# EAGLE design LCD_KEYb_final_rev02 (EAGLE 9.6.2)
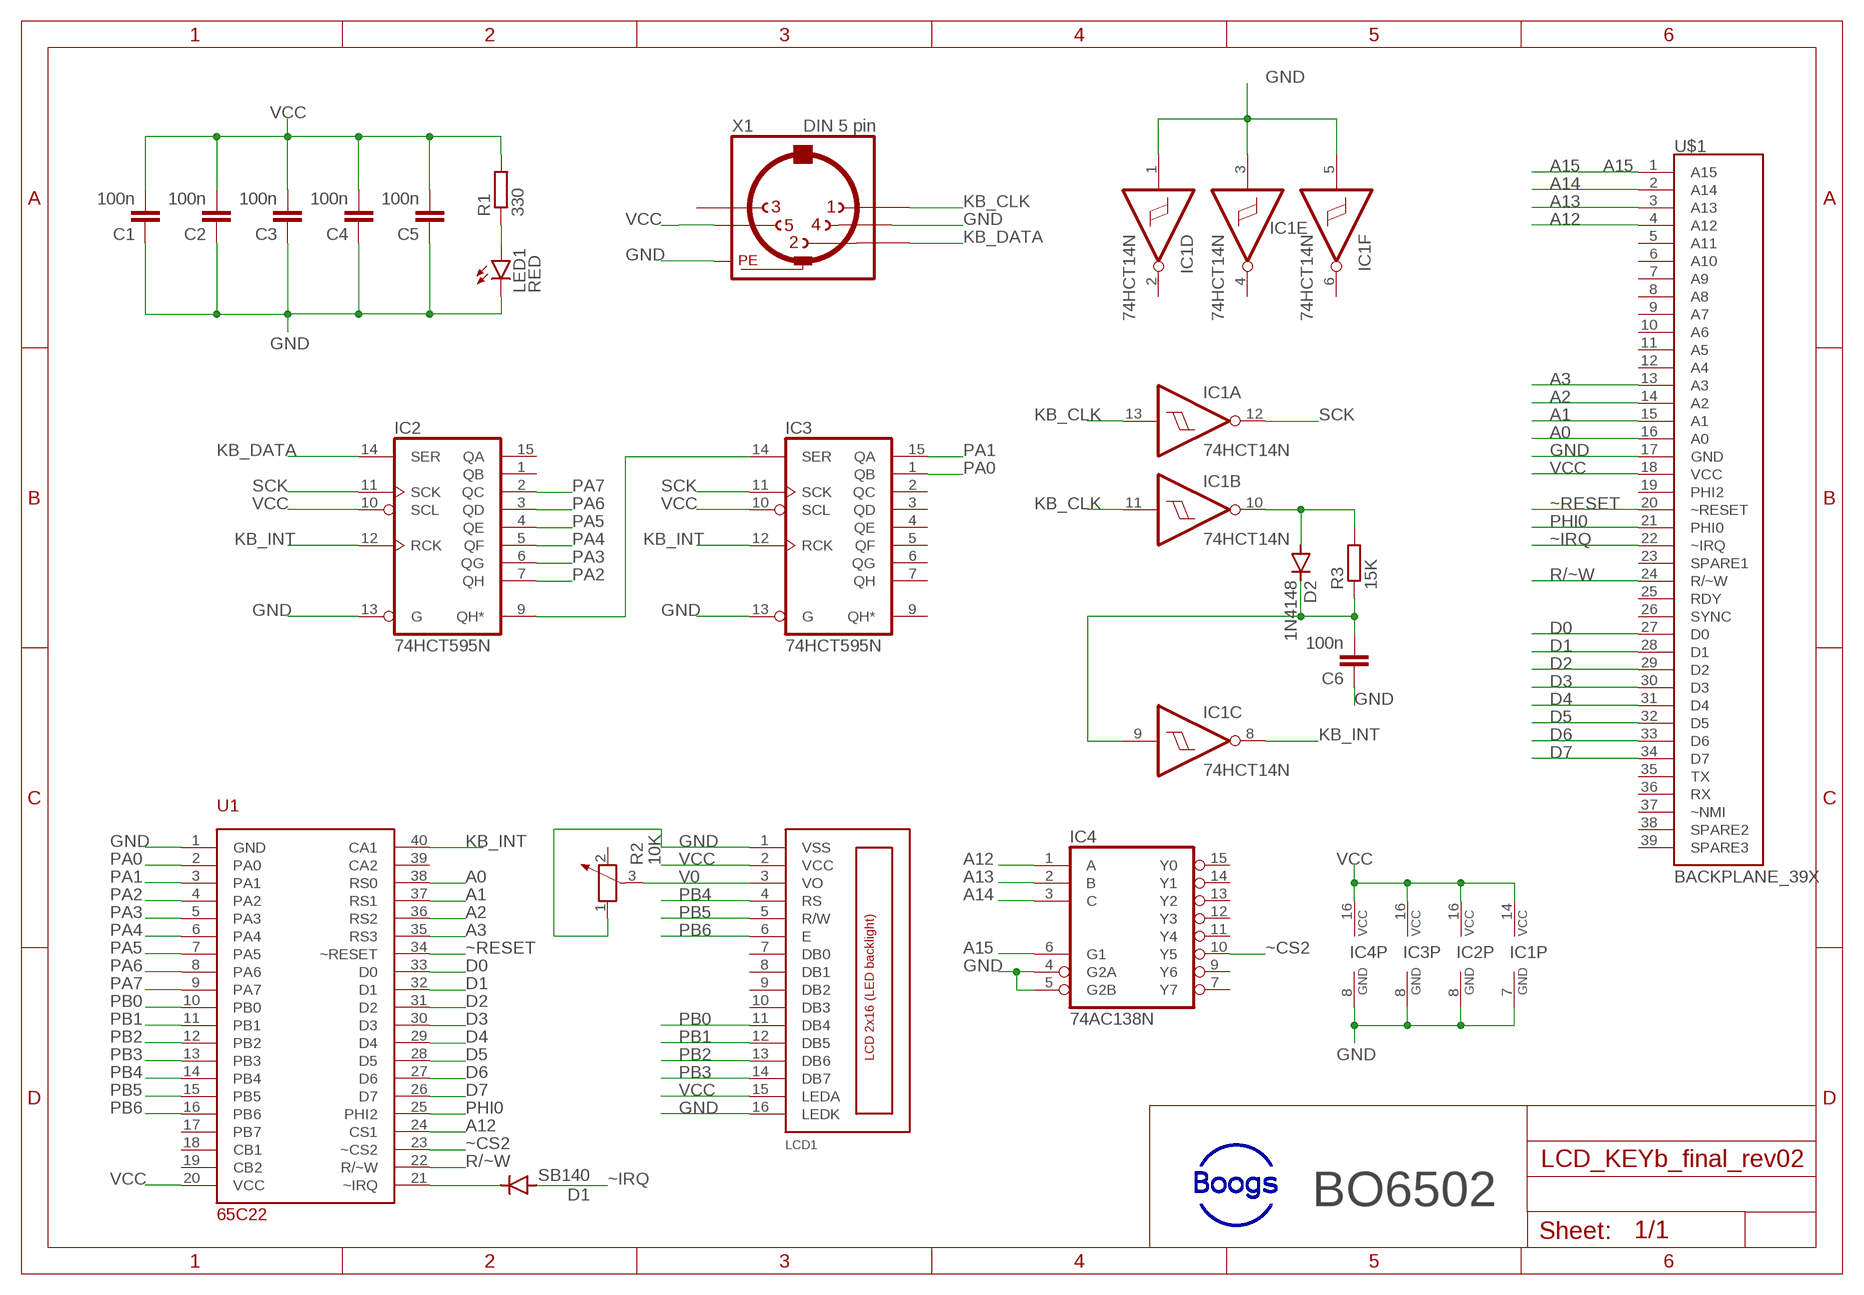
[diagram p0: schematic, sheet 1]

## Parts
C1  100n  C-EU025-025X050  [C025-025X050]
C2  100n  C-EU025-025X050  [C025-025X050]
C3  100n  C-EU025-025X050  [C025-025X050]
C4  100n  C-EU025-025X050  [C025-025X050]
C5  100n  C-EU025-025X050  [C025-025X050]
C6  100n  C-EU025-025X050  [C025-025X050]
D1  SB140  1N4004  [DO41-10]
D2  1N4148  1N4148DO35-7  [DO35-7]
IC1  74HCT14N  [DIL14]
IC2  74HCT595N  [DIL16]
IC3  74HCT595N  [DIL16]
IC4  74AC138N  [DIL16]
LCD1  LCD_2X16_SIL  [HY-1602F]
LED1  RED  LED5MM  [LED5MM]
R1  330  R-EU_0207/10  [0207/10]
R2  10K  POTENTIOMETER_PT-10  [PT-10]
R3  15K  R-EU_0207/10  [0207/10]
U1  65C22  [DIL40]
U$1  BACKPLANE_39X  [BP_39X]
X1  DIN 5 pin  MAB5SH  [MAB5SH]

## Nets
A0: U1.38(RS0) U$1.16(A0)
A1: U1.37(RS1) U$1.15(A1)
A2: U1.36(RS2) U$1.14(A2)
A3: U1.35(RS3) U$1.13(A3)
A12: IC4.1(A) U1.24(CS1) U$1.4(A12)
A13: IC4.2(B) U$1.3(A13)
A14: IC4.3(C) U$1.2(A14)
A15: IC4.6(G1) U$1.1(A15)
D0: U1.33(D0) U$1.27(D0)
D1: U1.32(D1) U$1.28(D1)
D2: U1.31(D2) U$1.29(D2)
D3: U1.30(D3) U$1.30(D3)
D4: U1.29(D4) U$1.31(D4)
D5: U1.28(D5) U$1.32(D5)
D6: U1.27(D6) U$1.33(D6)
D7: U1.26(D7) U$1.34(D7)
GND: C1.1 C2.1 C3.1 C4.1 C5.1 C6.1 IC1.1(D:I) IC1.3(E:I) IC1.5(F:I) IC1.7(P:GND) IC2.8(GND) IC2.13(G) IC3.8(GND) IC3.13(G) IC4.4(G2A) IC4.5(G2B) IC4.8(GND) LCD1.1(VSS) LCD1.16(LEDK) LED1.K(C) R2.1 U1.1(GND) U$1.17(GND) X1.4 X1.PE X1.PE@(PE)
KB_CLK: IC1.11(B:I) IC1.13(A:I) X1.1
KB_DATA: IC2.14(SER) X1.2
KB_INT: IC1.8(C:O) IC2.12(RCK) IC3.12(RCK) U1.40(CA1)
N$1: D1.C U1.21(~IRQ)
N$2: IC2.9(QH*) IC3.14(SER)
N$4: D2.A IC1.10(B:O) R3.2
N$5: C6.2 D2.C IC1.9(C:I) R3.1
N$6: LED1.A R1.1
PA0: IC3.1(QB) U1.2(PA0)
PA1: IC3.15(QA) U1.3(PA1)
PA2: IC2.7(QH) U1.4(PA2)
PA3: IC2.6(QG) U1.5(PA3)
PA4: IC2.5(QF) U1.6(PA4)
PA5: IC2.4(QE) U1.7(PA5)
PA6: IC2.3(QD) U1.8(PA6)
PA7: IC2.2(QC) U1.9(PA7)
PB0: LCD1.11(DB4) U1.10(PB0)
PB1: LCD1.12(DB5) U1.11(PB1)
PB2: LCD1.13(DB6) U1.12(PB2)
PB3: LCD1.14(DB7) U1.13(PB3)
PB4: LCD1.4(RS) U1.14(PB4)
PB5: LCD1.5(R/W) U1.15(PB5)
PB6: LCD1.6(E) U1.16(PB6)
PHI0: U1.25(PHI2) U$1.21(PHI0)
R/~W: U1.22(R/~W) U$1.24(R/~W)
SCK: IC1.12(A:O) IC2.11(SCK) IC3.11(SCK)
V0: LCD1.3(VO) R2.3
VCC: C1.2 C2.2 C3.2 C4.2 C5.2 IC1.14(P:VCC) IC2.10(SCL) IC2.16(VCC) IC3.10(SCL) IC3.16(VCC) IC4.16(VCC) LCD1.2(VCC) LCD1.15(LEDA) R1.2 U1.20(VCC) U$1.18(VCC) X1.5
~CS2: IC4.10(Y5) U1.23(~CS2)
~IRQ: D1.A U$1.22(~IRQ)
~RESET: U1.34(~RESET) U$1.20(~RESET)
Unconnected: IC1.2(D:O) IC1.4(E:O) IC1.6(F:O) IC2.1(QB) IC2.15(QA) IC3.2(QC) IC3.3(QD) IC3.4(QE) IC3.5(QF) IC3.6(QG) IC3.7(QH) IC3.9(QH*) IC4.7(Y7) IC4.9(Y6) IC4.11(Y4) IC4.12(Y3) IC4.13(Y2) IC4.14(Y1) IC4.15(Y0) LCD1.7(DB0) LCD1.8(DB1) LCD1.9(DB2) LCD1.10(DB3) R2.2 U1.17(PB7) U1.18(CB1) U1.19(CB2) U1.39(CA2) U$1.5(A11) U$1.6(A10) U$1.7(A9) U$1.8(A8) U$1.9(A7) U$1.10(A6) U$1.11(A5) U$1.12(A4) U$1.19(PHI2) U$1.23(SPARE1) U$1.25(RDY) U$1.26(SYNC) U$1.35(TX) U$1.36(RX) U$1.37(~NMI) U$1.38(SPARE2) U$1.39(SPARE3) X1.3

## Notes on the sheet
- BO6502

## Library data of the parts
C1-C6 = rcl:C-EU: CAPACITOR, European symbol; SPICEPREFIX: C
D1 = diode:1N4004: DIODE general purpose rectifier, 1 A
D2 = diode:1N4148: DIODE high speed (Philips)
IC1 = 74xx-eu:74*14: Hex schmitt trigger INVERTER
IC2 IC3 = 74xx-eu:74*595: 8-bit SHIFT REGISTER, output latch
IC4 = 74xx-eu:74*138: 3-line to 8-line DECODER/DEMULTIPLEXER
LCD1 = lcd_2x16_led_backlight:LCD_2X16_SIL
LED1 = led:LED: LED OSRAM: - CHIPLED LG R971, LG N971, LY N971, LG Q971, LY Q971, LO R971, LY R971 LH N974, LH R974 LS Q976, LO Q976, LY Q976 LO Q996 - Hyper CHIPLED LW Q18S LB Q993, LB Q99A, LB R99A - SideLED LS A670, LO A670, LY A670, LG A670, LP A670 LB A673, LV A673, LT A673, LW A673 LH A674 LY A675 LS A676, LA A676, LO A676, LY A676, LW A676 LS A679, LY A679, LG A679 - Hyper Micro SIDELED® LS Y876, LA Y876, LO Y876, LY Y876 LT Y87S - SmartLED LW L88C, LW L88S LB L89C, LB L89S, LG L890 LS L89K, LO L89K, LY L89K LS L896, LA L896, LO L896, LY L896 - TOPLED LS T670, LO T670, LY T670, LG T670, LP T670 LSG T670, LSP T670, LSY T670, LOP T670, LYG T670 LG T671, LOG T671, LSG T671 LB T673, LV T673, LT T673, LW T673 LH T674 LS T676, LA T676, LO T676, LY T676, LB T676, LH T676, LSB T676, LW T676 LB T67C, LV T67C, LT T67C, LS T67K, LO T67K, LY T67K, LW E67C LS E67B, LA E67B, LO E67B, LY E67B, LB E67C, LV E67C, LT E67C LW T67C LS T679, LY T679, LG T679 LS T770, LO T770, LY T770, LG T770, LP T770 LB T773, LV T773, LT T773, LW T773 LH T774 LS E675, LA E675, LY E675, LS T675 LS T776, LA T776, LO T776, LY T776, LB T776 LHGB T686 LT T68C, LB T68C - Hyper Mini TOPLED® LB M676 - Mini TOPLED Santana® LG M470 LS M47K, LO M47K, LY M47K Source: http://www.osram.convergy.de LUXEON: - LUMILED® LXK2-PW12-R00, LXK2-PW12-S00, LXK2-PW14-U00, LXK2-PW14-V00 LXK2-PM12-R00, LXK2-PM12-S00, LXK2-PM14-U00 LXK2-PE12-Q00, LXK2-PE12-R00, LXK2-PE12-S00, LXK2-PE14-T00, LXK2-PE14-U00 LXK2-PB12-K00, LXK2-PB12-L00, LXK2-PB12-M00, LXK2-PB14-N00, LXK2-PB14-P00, LXK2-PB14-Q00 LXK2-PR12-L00, LXK2-PR12-M00, LXK2-PR14-Q00, LXK2-PR14-R00 LXK2-PD12-Q00, LXK2-PD12-R00, LXK2-PD12-S00 LXK2-PH12-R00, LXK2-PH12-S00 LXK2-PL12-P00, LXK2-PL12-Q00, LXK2-PL12-R00 Source: www.luxeon.com KINGBRIGHT: KA-3528ASYC Source: www.kingbright.com
R1 R3 = rcl:R-EU_: RESISTOR, European symbol; SPICEPREFIX: R
R2 = rcl:POTENTIOMETER_: Potentiometer; SPICEMODEL: POT; SPICEPREFIX: X
U1 = 65xx_family:65C22
U$1 = 65xx_family:BACKPLANE_39X; A15: A15
X1 = con-hirschmann_mod:MAB5SH: Female CONNECTOR 5 pins 90 deg. with shield, horizontal (DIN 41524); OC_FARNELL: 809883; OC_NEWARK: unknown

## Board
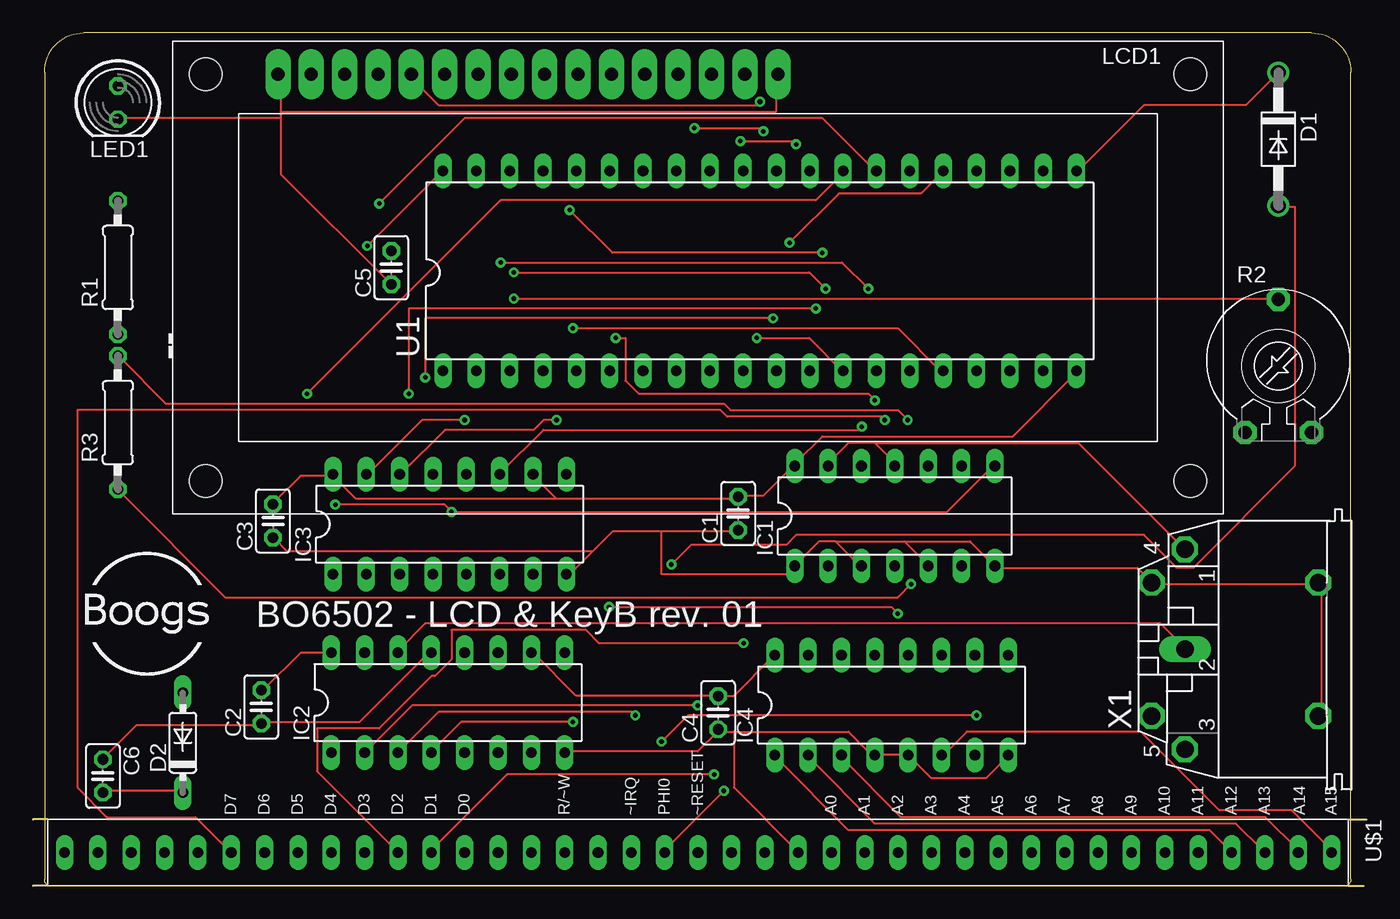
[diagram p1: board, top side]
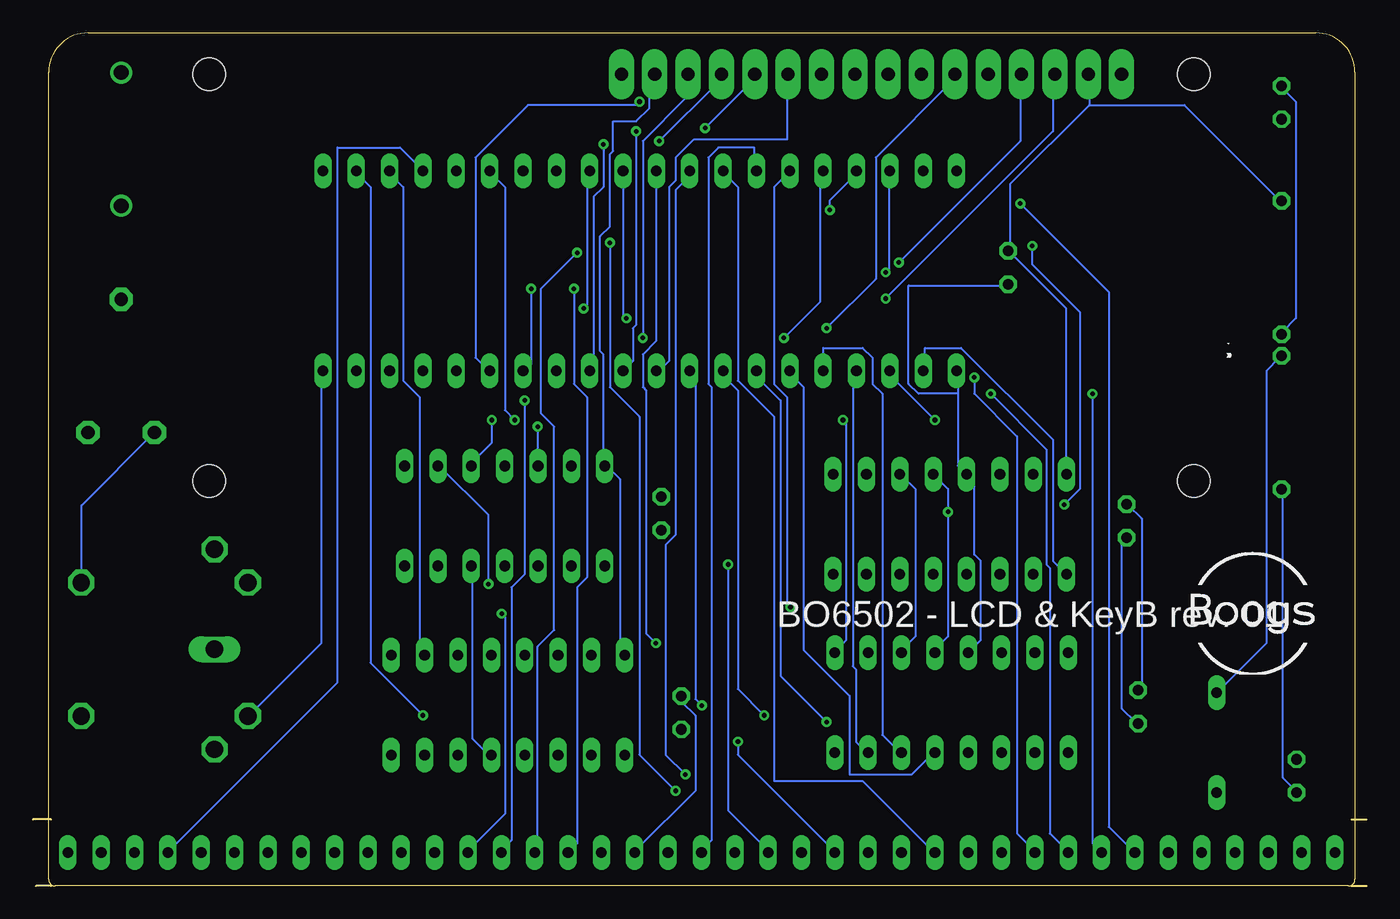
[diagram p2: board, bottom side, seen from below]

Size 101.6 x 65 mm. Coordinates in mm from the lower left corner, seen from the top.
Outline: 1.14,5.08 0,5.08
Outline: 1.14,0 0,0
Outline: 100.2,5.08 101.6,5.08
Outline: 100.2,0 101.35,0
Outline: 1.39,0 99.89,0 arc90 100.39,0.5 100.39,62 arc90 97.39,65 3.89,65 arc90 0.89,62 0.89,0.5 arc90 1.39,0
Copper layers (1*16): Top 0.035mm / dielectric 1.5mm / Bottom 0.035mm
Design rules "default *": minimum track width 6mil, minimum drill 0.35mm, track to track 10mil, track to pad 10mil, pad to pad 10mil, via to via 10mil, smd to smd 6mil, copper to edge 40mil, drill to drill 6mil, minimum pad ring 10mil, minimum via ring 8mil, stop-mask expansion 4mil, vias tented up to drill 15mil, thermal gap 10mil

### Footprints (pad centres in the part's own frame; a part is rotated, then mirrored left to right if it is on the bottom)
C025-025X050 = drill 0.813 octagon: 1 -1.27,0; 2 1.27,0
DO41-10 = drill 1.118: A 5.08,0; C -5.08,0
DO35-7 = drill 0.813 long: A 3.81,0; C -3.81,0
DIL14 = drill 0.813 long: 1 -7.62,-3.81; 2 -5.08,-3.81; 3 -2.54,-3.81; 4 0,-3.81; 5 2.54,-3.81; 6 5.08,-3.81; 7 7.62,-3.81; 8 7.62,3.81; 9 5.08,3.81; 10 2.54,3.81; 11 0,3.81; 12 -2.54,3.81; 13 -5.08,3.81; 14 -7.62,3.81
DIL16 = drill 0.813 long: 1 -8.89,-3.81; 2 -6.35,-3.81; 3 -3.81,-3.81; 4 -1.27,-3.81; 5 1.27,-3.81; 6 3.81,-3.81; 7 6.35,-3.81; 8 8.89,-3.81; 9 8.89,3.81; 10 6.35,3.81; 11 3.81,3.81; 12 1.27,3.81; 13 -1.27,3.81; 14 -3.81,3.81; 15 -6.35,3.81; 16 -8.89,3.81
HY-1602F = drill 1 pad 1.93 long: 1 2.54,0; 2 5.08,0; 3 7.62,0; 4 10.16,0; 5 12.7,0; 6 15.24,0; 7 17.78,0; 8 20.32,0; 9 22.86,0; 10 25.4,0; 11 27.94,0; 12 30.48,0; 13 33.02,0; 14 35.56,0; 15 38.1,0; 16 40.64,0 | hole 2.5: -2.96,0; 72.04,0; -2.96,-31; 72.04,-31
LED5MM = drill 0.813 octagon: A -1.27,0; K 1.27,0
0207/10 = drill 0.813 octagon: 1 -5.08,0; 2 5.08,0
PT-10 = drill 1.016 pad 1.778 octagon: 1 -2.54,-5.08; 2 2.54,-5.08; 3 0,5.08
DIL40 = drill 0.813 long: 1 -24.13,-7.62; 2 -21.59,-7.62; 3 -19.05,-7.62; 4 -16.51,-7.62; 5 -13.97,-7.62; 6 -11.43,-7.62; 7 -8.89,-7.62; 8 -6.35,-7.62; 9 -3.81,-7.62; 10 -1.27,-7.62; 11 1.27,-7.62; 12 3.81,-7.62; 13 6.35,-7.62; 14 8.89,-7.62; 15 11.43,-7.62; 16 13.97,-7.62; 17 16.51,-7.62; 18 19.05,-7.62; 19 21.59,-7.62; 20 24.13,-7.62; 21 24.13,7.62; 22 21.59,7.62; 23 19.05,7.62; 24 16.51,7.62; 25 13.97,7.62; 26 11.43,7.62; 27 8.89,7.62; 28 6.35,7.62; 29 3.81,7.62; 30 1.27,7.62; 31 -1.27,7.62; 32 -3.81,7.62; 33 -6.35,7.62; 34 -8.89,7.62; 35 -11.43,7.62; 36 -13.97,7.62; 37 -16.51,7.62; 38 -19.05,7.62; 39 -21.59,7.62; 40 -24.13,7.62
BP_39X = drill 0.813 long: 1 1.27,59.69; 2 1.27,57.15; 3 1.27,54.61; 4 1.27,52.07; 5 1.27,49.53; 6 1.27,46.99; 7 1.27,44.45; 8 1.27,41.91; 9 1.27,39.37; 10 1.27,36.83; 11 1.27,34.29; 12 1.27,31.75; 13 1.27,29.21; 14 1.27,26.67; 15 1.27,24.13; 16 1.27,21.59; 17 1.27,19.05; 18 1.27,16.51; 19 1.27,13.97; 20 1.27,11.43; 21 1.27,8.89; 22 1.27,6.35; 23 1.27,3.81; 24 1.27,1.27; 25 1.27,-1.27; 26 1.27,-3.81; 27 1.27,-6.35; 28 1.27,-8.89; 29 1.27,-11.43; 30 1.27,-13.97; 31 1.27,-16.51; 32 1.27,-19.05; 33 1.27,-21.59; 34 1.27,-24.13; 35 1.27,-26.67; 36 1.27,-29.21; 37 1.27,-31.75; 38 1.27,-34.29; 39 1.27,-36.83
MAB5SH = drill 1.321 octagon: 1 7.62,5.08; 3 -7.62,5.08; 4 5.08,7.62; 5 -5.08,7.62; PE -5.08,-5.08; PE@ 5.08,-5.08 | drill 1.321 long: 2 0,5.08

### Placement (x,y rotation side)
C1  53.72,28.38 90 top
C2  17.4,13.65 90 top
C3  18.29,27.81 90 top
C4  52.2,13.21 90 top
C5  27.3,47.12 90 top
C6  5.33,8.38 270 top
D1  94.87,56.9 270 top
D2  11.43,10.92 90 top
IC1  65.66,28.19 0 top
IC2  31.62,13.97 0 top
IC3  31.75,27.56 0 top
IC4  65.41,13.78 0 top
LCD1  16.13,61.85 0 top
LED1  6.48,59.69 270 top
R1  6.48,47.12 90 top
R2  94.87,39.62 0 top
R3  6.48,35.31 90 top
U1  55.37,46.86 0 top
U$1  39.24,3.81 270 top
X1  92.84,18.03 90 top

### Tracks (layer width: path | path; a pad name or v marks a point on that pad's centre or on a via)
A0  (via drill 0.35)
  Top 0.152: v60.39,45.5 59.14,46.75 v36.64,46.75
  Bottom 0.152: v60.39,45.5 60.39,38.25 59.39,37.25 59.39,23.5 60.14,22.75 60.14,3.25 60.64,2.75 U$1.16 | v36.64,46.75 36.39,47 36.39,54.25 U1.38
A1  (via drill 0.35)
  Top 0.152: v40.89,51.5 44.14,48.25 v60.14,48.25
  Bottom 0.152: v40.89,51.5 40.89,52.25 38.89,54.25 U1.37 | v60.14,48.25 62.89,45.5 62.89,36 61.89,35 61.89,19.5 63.14,18.25 63.14,2.75 U$1.15
A2  (via drill 0.35)
  Top 0.152: v64.14,37 63.64,37.5 46.14,37.5 45.14,38.5 45.14,41.75 v44.39,41.75
  Bottom 0.152: v64.14,37 64.14,23.75 65.14,22.75 65.14,3.5 65.89,2.75 U$1.14 | v44.39,41.75 41.64,44.5 41.64,54.25 U1.36
A3  (via drill 0.35)
  Top 0.152: v65.89,20.75 65.39,21.25 v43.89,21.25
  Bottom 0.152: v65.89,20.75 65.64,20.5 65.64,5.5 68.39,2.75 U$1.13 | v43.89,21.25 44.14,21.5 44.14,37.25 45.14,38.25 45.14,53.25 44.14,54.25 U1.35
A12
  Top 0.152: IC4.1 56.64,9.75 62.14,4.25 89.64,4.25 91.14,2.75 U$1.4
  Bottom 0.152: U1.24 71.89,54.5 73.64,56.25 78.39,56.25 78.39,15.5 91.14,2.75 U$1.4
A13
  Top 0.152: IC4.2 59.14,9.75 64.14,4.75 91.64,4.75 93.64,2.75 U$1.3
A14
  Top 0.152: IC4.3 61.64,9.75 66.14,5.25 93.89,5.25 96.39,2.75 U$1.2
A15
  Top 0.152: IC4.6 69.39,10 71.14,11.75 84.39,11.75 90.39,5.75 95.89,5.75 98.89,2.75 U$1.1
D0
  Bottom 0.152: U$1.27 33.14,2.75 38.39,8 45.14,8 45.14,35.75 47.89,38.5 47.89,53.25 48.89,54.25 U1.33
D1  (via drill 0.35)
  Top 0.152: v51.89,8.5 36.14,8.5 30.39,2.75 U$1.28
  Bottom 0.152: v51.89,8.5 53.39,10 53.39,26 52.64,26.75 52.64,53 51.64,54 51.64,54.25 U1.32
D2  (via drill 0.35)
  Top 0.152: v54.14,18.5 43.14,18.5 42.14,19.5 31.89,19.5 31.89,17.25 30.64,16 30.39,16 26.39,12 21.64,12 21.64,8.75 27.64,2.75 U$1.29
  Bottom 0.152: v54.14,18.5 54.89,19.25 54.89,37.75 55.14,38 55.14,40.5 54.14,41.5 54.14,54.25 U1.31
D3  (via drill 0.35)
  Top 0.152: v29.89,38.75 29.89,43.25 v56.39,43.25
  Bottom 0.152: v29.89,38.75 29.89,37.5 26.64,34.25 26.64,4 25.39,2.75 U$1.30 | v56.39,43.25 56.64,43.5 56.64,54.25 U1.30
D4  (via drill 0.35)
  Top 0.152: v28.64,37.5 28.64,44 v59.64,44
  Bottom 0.152: v28.64,37.5 24.39,33.25 24.39,24.5 24.14,24.25 24.14,4 22.89,2.75 U$1.31 | v59.64,44 59.39,44.25 59.39,54.25 U1.29
D5  (via drill 0.35)
  Top 0.152: v20.89,37.5 35.64,52.25 59.64,52.25 61.64,54.25 U1.28
  Bottom 0.152: v20.89,37.5 20.89,3.25 20.39,2.75 U$1.32
D6  (via drill 0.35)
  Top 0.152: v26.39,52 32.89,58.5 60.14,58.5 64.14,54.5 U1.27
  Bottom 0.152: v26.39,52 19.64,45.25 19.64,4.5 17.89,2.75 U$1.33
D7  (via drill 0.35)
  Top 0.152: v64.89,35.5 64.64,35.75 52.89,35.75 52.39,36.25 3.39,36.25 3.39,7.5 5.64,5.25 12.39,5.25 14.89,2.75 U$1.34
  Bottom 0.152: v64.89,35.5 65.64,36.25 65.64,53.25 66.64,54.25 U1.26
GND
  Top 0.152: 18.89,59 18.89,61.75 LCD1.1 | 18.89,59 18.89,58.5 | 18.89,58.5 18.89,54.25 27.14,46 C5.1 | 18.89,58.5 6.64,58.5 LED1.K | 18.89,59 56.64,59 56.64,61.75 LCD1.16 | C6.1 5.39,9.75 7.89,12.25 17.39,12.25 C2.1 17.64,12.5 24.89,12.5 30.14,17.75 IC2.13 | IC4.8 74.14,9.75 72.64,8.25 68.39,8.25 66.89,9.75 IC4.5 66.64,10 64.14,10 IC4.4 63.89,10 62.14,11.75 53.39,11.75 | IC2.8 40.64,10.25 50.64,10.25 52.14,11.75 C4.1 52.39,11.75 53.39,11.75 | 53.39,11.75 53.39,7.5 58.14,2.75 U$1.17 | X1.PE 98.14,13 98.14,23 X1.PE@ 97.89,23 85.39,23 X1.4 85.14,23.25 84.14,24.25 73.39,24.25 IC1.7 73.14,24.5 71.39,26.25 66.39,26.25 | 42.64,25.5 44.14,27 47.89,27 | 42.64,25.5 40.89,23.75 IC3.8 | 47.89,27 53.64,27 C1.1 | 61.14,26.25 59.89,26.25 58.14,24.5 IC1.1 57.89,24.25 57.39,23.75 47.89,23.75 47.89,27 | 61.14,26.25 62.89,24.5 IC1.3 | 66.39,26.25 68.14,24.5 IC1.5 | 61.14,26.25 66.39,26.25 | 42.64,25.5 19.39,25.5 18.39,26.5 C3.1
  Bottom 0.152: 31.14,37.5 31.14,39 U1.1 | 31.14,37.5 31.14,32 30.64,31.5 IC3.13 30.39,31.25 29.89,30.75 29.89,25.25 29.39,24.75 29.39,18.75 30.14,18 IC2.13 | C3.1 18.39,26.5 18.64,26.25 18.64,13.5 17.64,12.5 C2.1 | R2.1 92.39,34.5 97.89,29 97.89,23.25 X1.PE@ | IC4.5 66.89,10 68.14,11.25 68.14,24.25 IC1.5 | 31.14,37.5 34.14,37.5 34.89,38.25 34.89,45.75 27.39,45.75 C5.1
KB_CLK
  Top 0.152: 64.14,33.75 62.14,33.75 60.64,32.25 IC1.13 | 64.14,33.75 65.64,32.25 IC1.11 | 64.14,33.75 79.64,33.75 87.64,25.75 X1.1
KB_DATA
  Top 0.152: IC2.14 27.89,18 29.89,20 85.89,20 87.64,18.25 X1.2
KB_INT  (via drill 0.35)
  Top 0.152: IC1.8 73.14,32 69.64,28.5 v31.89,28.5 31.77,28.65 31.37,29.06 v23.04,29.06 | v25.48,48.77 31.17,54.46 U1.40
  Bottom 0.152: IC2.12 32.89,18 31.89,19 v31.89,28.5 31.89,30.25 32.89,31.25 IC3.12 | v25.48,48.77 25.48,47.35 21.82,43.69 21.82,30.28 v23.04,29.06
N$1
  Top 0.152: U1.21 79.64,54.5 84.64,59.5 92.39,59.5 94.64,61.75 D1.C
N$2  (via drill 0.35)
  Top 0.152: v39.89,35.5 38.89,35.5 38.14,34.75 31.39,34.75 28.14,31.5 IC3.14
  Bottom 0.152: v39.89,35.5 39.64,35.25 39.64,18.75 40.39,18 IC2.9
N$4  (via drill 0.35)
  Top 0.152: v66.64,35.5 65.89,36.25 53.14,36.25 52.64,36.75 10.14,36.75 6.64,40.25 R3.2
  Bottom 0.152: D2.A 11.39,14.75 7.64,18.5 7.64,39.25 6.64,40.25 R3.2 | v66.64,35.5 66.64,33.75 68.14,32.25 IC1.10
N$5  (via drill 0.35)
  Top 0.152: C6.2 5.39,7.25 11.39,7.25 D2.C | v66.89,23 65.89,22 14.64,22 6.64,30 R3.1
  Bottom 0.152: R3.1 6.39,30 6.39,8.25 5.39,7.25 C6.2 | v66.89,23 66.89,28.25 70.64,32 IC1.9
N$6
  Bottom 0.152: R1.1 6.39,42.25 5.39,43.25 5.39,59.75 6.39,60.75 LED1.A
PA0
  Bottom 0.152: IC3.1 22.89,23.75 23.89,24.75 23.89,34 30.89,41 33.64,41 33.64,39.25 U1.2
PA1  (via drill 0.35)
  Top 0.152: v32.89,35.5 29.64,35.5 25.64,31.5 IC3.15
  Bottom 0.152: v32.89,35.5 36.14,38.75 36.14,39 U1.3
PA2
  Bottom 0.152: IC2.7 38.14,10.25 38.89,11 38.89,16.5 39.14,16.75 39.14,38.75 38.89,39 U1.4
PA3
  Bottom 0.152: IC2.6 35.64,10.25 36.89,11.5 36.89,37.5 37.64,38.25 37.64,40.25 38.39,41 41.39,41 U1.5
PA4
  Bottom 0.152: IC2.5 33.14,10 34.64,8.5 39.39,8.5 39.39,14.5 42.89,18 42.89,38 43.89,39 U1.6
PA5  (via drill 0.35)
  Top 0.152: v41.14,12.5 32.64,12.5 30.39,10.25 IC2.4
  Bottom 0.152: v41.14,12.5 44.64,16 44.64,37 46.39,38.75 46.39,39 U1.7
PA6  (via drill 0.35)
  Top 0.152: v45.89,13 45.64,13.25 30.89,13.25 27.89,10.25 IC2.3
  Bottom 0.152: v45.89,13 47.89,15 47.89,37.75 48.89,38.75 48.89,39 U1.8
PA7  (via drill 0.35)
  Top 0.152: v50.64,13.75 28.89,13.75 25.39,10.25 IC2.2
  Bottom 0.152: v50.64,13.75 51.14,14.25 51.14,38.75 51.39,39 U1.9
PB0
  Bottom 0.152: U1.10 53.89,39.25 53.14,40 53.14,53.25 52.64,53.75 52.64,55.5 51.27,56.87 44.14,56.87 44.14,61.75 LCD1.11
PB1  (via drill 0.35)
  Top 0.152: v55.64,57.5 55.39,57.75 v50.39,57.75
  Bottom 0.152: v55.64,57.5 55.64,42.75 55.89,42.5 55.89,40 U1.11 | v50.39,57.75 46.64,61.5 46.64,61.75 LCD1.12
PB2  (via drill 0.35)
  Top 0.152: v58.14,56.5 57.89,56.75 v53.89,56.75
  Bottom 0.152: v58.14,56.5 58.14,53.25 58.89,52.5 58.89,39.5 59.14,39.25 U1.12 | v53.89,56.75 49.39,61.25 49.39,61.75 LCD1.13
PB3  (via drill 0.35)
  Top 0.152: v55.14,41.75 59.14,41.75 61.64,39.25 U1.13
  Bottom 0.152: v55.14,41.75 55.14,56.75 51.89,60 51.89,61.75 LCD1.14
PB4  (via drill 0.35)
  Top 0.152: v63.64,45.5 61.64,47.5 v35.64,47.5
  Bottom 0.152: v63.64,45.5 63.64,39.75 64.14,39.25 U1.14 | v35.64,47.5 26.39,56.75 26.39,61.75 LCD1.4
PB5  (via drill 0.35)
  Top 0.152: v55.39,59.75 55.14,59.5 30.89,59.5 28.64,61.75 LCD1.5
  Bottom 0.152: v55.39,59.75 55.39,59.5 63.89,59.5 67.89,55.5 67.89,40.25 66.89,39.25 U1.15
PB6  (via drill 0.35)
  Top 0.152: v41.14,42.5 65.89,42.5 69.14,39.25 U1.16
  Bottom 0.152: v41.14,42.5 37.39,46.25 37.39,55.5 31.39,61.5 31.39,61.75 LCD1.6
PHI0  (via drill 0.35)
  Top 0.152: v52.64,7.25 48.14,2.75 U$1.21 | v57.64,49 61.39,52.75 67.64,52.75 69.14,54.25 U1.25
  Bottom 0.152: v52.64,7.25 55.39,10 55.39,35.75 57.64,38 v57.64,49
R/~W  (via drill 0.35)
  Top 0.152: v47.89,11 49.89,13 v71.89,13
  Bottom 0.152: v47.89,11 47.89,10 40.64,2.75 U$1.24 | v71.89,13 75.89,17 75.89,53.25 76.89,54.25 U1.22
SCK  (via drill 0.35)
  Top 0.152: v63.14,35 62.89,34.75 38.89,34.75 35.64,31.5 IC3.11
  Bottom 0.152: IC2.11 35.39,18 34.39,19 34.39,30.25 35.39,31.25 IC3.11 | v63.14,35 63.14,32.25 IC1.12
V0  (via drill 0.35)
  Top 0.152: v36.64,44.75 94.64,44.75 R2.3
  Bottom 0.152: v36.64,44.75 23.89,57.5 23.89,61.75 LCD1.3
VCC
  Top 0.152: C2.2 17.64,15 20.39,17.75 22.64,17.75 IC2.16 | C3.2 18.39,29.25 20.39,31.25 22.64,31.25 IC3.16 22.89,31.25 24.64,29.5 39.89,29.5 | IC2.10 38.14,17.75 41.39,14.5 52.14,14.5 C4.2 52.39,14.5 53.39,14.5 56.39,17.5 IC4.16 | 39.89,29.5 38.14,31.25 IC3.10 | 39.89,29.5 53.64,29.5 C1.2 53.89,29.75 55.64,29.75 57.89,32 IC1.14 58.14,32.25 60.14,34.25 74.64,34.25 79.39,39 U1.20
  Bottom 0.152: 21.14,59.5 13.89,59.5 6.64,52.25 R1.2 | 21.14,59.5 21.14,61.75 LCD1.2 | IC3.16 22.89,31.5 22.89,44 27.14,48.25 C5.2 27.14,48.5 27.14,53.5 21.14,59.5 | C2.2 17.39,15 17.14,15.25 17.14,28 18.14,29 C3.2 | U$1.18 55.64,2.75 51.14,7.25 51.14,13 52.14,14 52.14,14.25 C4.2 | LCD1.15 54.39,61.75 54.64,61.5 54.64,59.25 55.64,58.25 57.39,58.25 57.39,56 57.64,55.75 57.64,50.25 58.39,49.5 58.39,40.75 58.14,40.5 58.14,32.25 IC1.14 57.89,32 56.89,31 56.89,18 56.64,17.75 IC4.16 | X1.5 85.14,13 79.64,18.5 79.64,39 U1.20
~CS2
  Bottom 0.152: IC4.10 71.89,17.75 72.14,18 72.14,37.25 73.39,38.5 73.39,53.25 74.39,54.25 U1.23
~IRQ  (via drill 0.35)
  Top 0.152: v48.64,24.5 50.14,26 57.39,26 58.14,26.75 84.64,26.75 87.14,24.25 88.39,24.25 96.14,32 96.14,51.75 94.89,51.75 D1.A
  Bottom 0.152: v48.64,24.5 48.64,5.75 45.64,2.75 U$1.22
~RESET
  Bottom 0.152: U$1.20 50.64,2.75 49.89,3.5 49.89,38 50.14,38.25 50.14,55.5 49.39,56.25 46.64,56.25 46.64,54.5 U1.34

### Text on the board
tNames: BO6502 - LCD & KeyB rev. 01 | D7 | D6 | D5 | D4 | D3 | D2 | D1 | D0 | R/~W | ~IRQ | PHI0 | ~RESET | A0 | A1 | A2 | A3 | A4 | A5 | A6 | A7 | A8 | A9 | A10 | A11 | A12 | A13 | A14 | A15
bNames: BO6502 - LCD & KeyB rev. 01